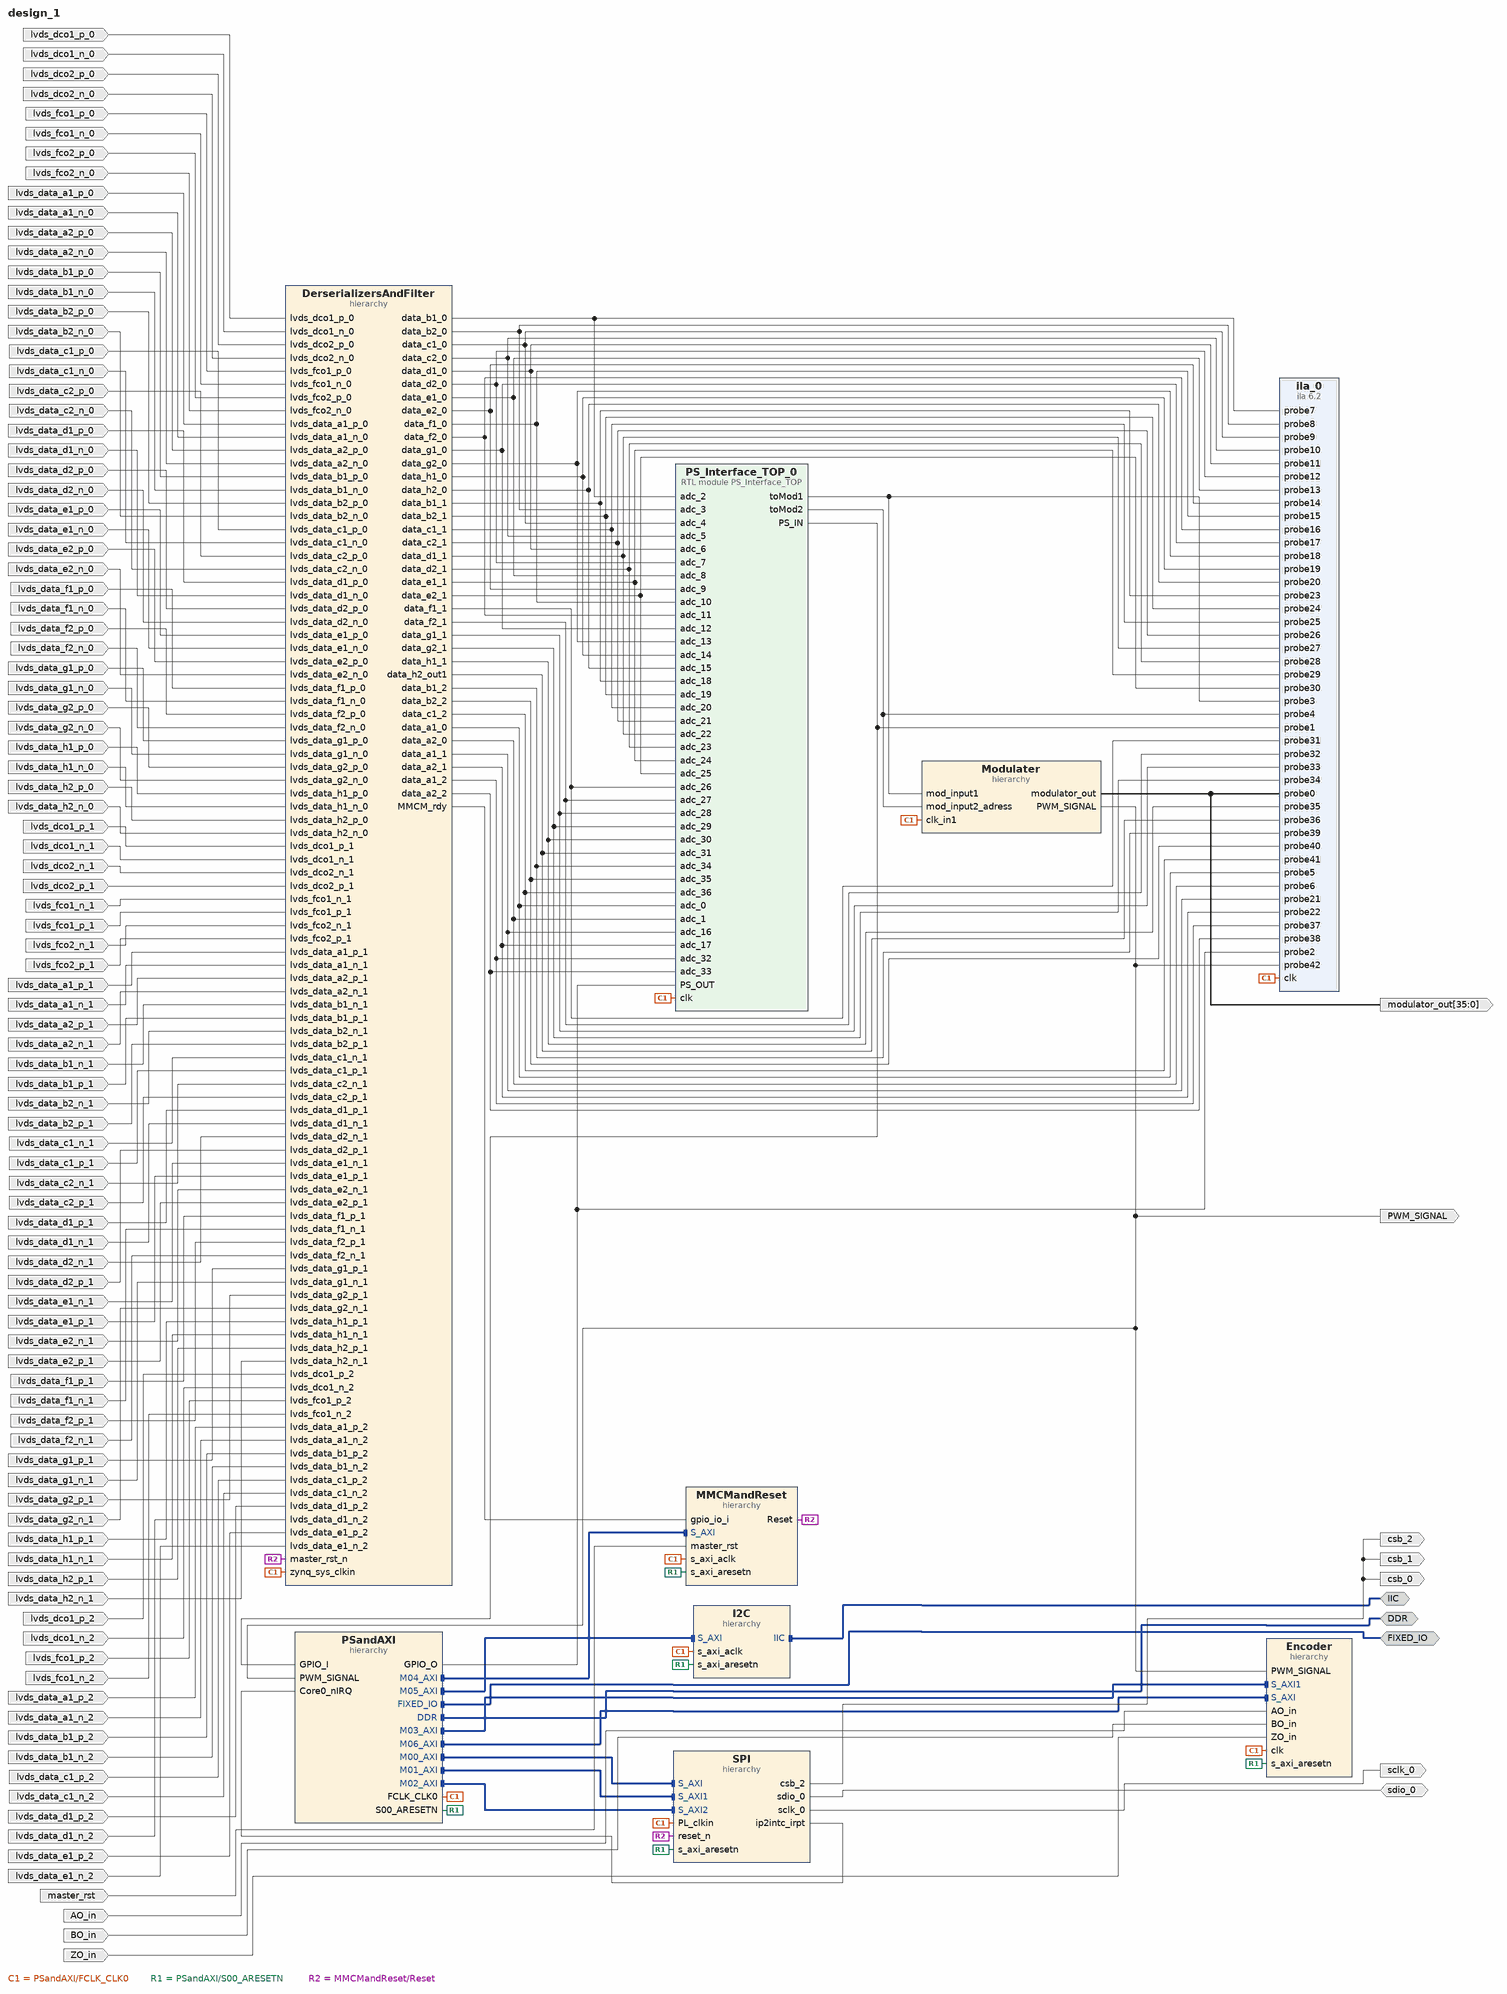
[diagram p0: block diagram of the top level]
# Vivado block design design_1, xc7z045ffg900-2, Vivado 2020.1
create_bd_design design_1

create_bd_intf_port -mode Master -vlnv xilinx.com:interface:ddrx_rtl:1.0 DDR
create_bd_intf_port -mode Master -vlnv xilinx.com:display_processing_system7:fixedio_rtl:1.0 FIXED_IO
create_bd_intf_port -mode Master -vlnv xilinx.com:interface:iic_rtl:1.0 IIC
create_bd_port -dir I AO_in
create_bd_port -dir I BO_in
create_bd_port -dir I ZO_in
create_bd_port -dir I lvds_dco1_p_0
create_bd_port -dir I lvds_dco1_n_0
create_bd_port -dir I lvds_dco2_p_0
create_bd_port -dir I lvds_dco2_n_0
create_bd_port -dir I lvds_fco1_p_0
create_bd_port -dir I lvds_fco1_n_0
create_bd_port -dir I lvds_fco2_p_0
create_bd_port -dir I lvds_fco2_n_0
create_bd_port -dir I lvds_data_a1_p_0
create_bd_port -dir I lvds_data_a1_n_0
create_bd_port -dir I lvds_data_a2_p_0
create_bd_port -dir I lvds_data_a2_n_0
create_bd_port -dir I lvds_data_b1_p_0
create_bd_port -dir I lvds_data_b1_n_0
create_bd_port -dir I lvds_data_b2_p_0
create_bd_port -dir I lvds_data_b2_n_0
create_bd_port -dir I lvds_data_c1_p_0
create_bd_port -dir I lvds_data_c1_n_0
create_bd_port -dir I lvds_data_c2_p_0
create_bd_port -dir I lvds_data_c2_n_0
create_bd_port -dir I lvds_data_d1_p_0
create_bd_port -dir I lvds_data_d1_n_0
create_bd_port -dir I lvds_data_d2_p_0
create_bd_port -dir I lvds_data_d2_n_0
create_bd_port -dir I lvds_data_e1_p_0
create_bd_port -dir I lvds_data_e1_n_0
create_bd_port -dir I lvds_data_e2_p_0
create_bd_port -dir I lvds_data_e2_n_0
create_bd_port -dir I lvds_data_f1_p_0
create_bd_port -dir I lvds_data_f1_n_0
create_bd_port -dir I lvds_data_f2_p_0
create_bd_port -dir I lvds_data_f2_n_0
create_bd_port -dir I lvds_data_g1_p_0
create_bd_port -dir I lvds_data_g1_n_0
create_bd_port -dir I lvds_data_g2_p_0
create_bd_port -dir I lvds_data_g2_n_0
create_bd_port -dir I lvds_data_h1_p_0
create_bd_port -dir I lvds_data_h1_n_0
create_bd_port -dir I lvds_data_h2_p_0
create_bd_port -dir I lvds_data_h2_n_0
create_bd_port -dir I lvds_data_a1_n_1
create_bd_port -dir I lvds_data_a1_p_1
create_bd_port -dir I lvds_data_a2_n_1
create_bd_port -dir I lvds_data_a2_p_1
create_bd_port -dir I lvds_data_b1_n_1
create_bd_port -dir I lvds_data_b1_p_1
create_bd_port -dir I lvds_data_b2_n_1
create_bd_port -dir I lvds_data_b2_p_1
create_bd_port -dir I lvds_data_c1_n_1
create_bd_port -dir I lvds_data_c1_p_1
create_bd_port -dir I lvds_data_c2_n_1
create_bd_port -dir I lvds_data_c2_p_1
create_bd_port -dir I lvds_data_d1_n_1
create_bd_port -dir I lvds_data_d1_p_1
create_bd_port -dir I lvds_data_d2_n_1
create_bd_port -dir I lvds_data_d2_p_1
create_bd_port -dir I lvds_data_e1_n_1
create_bd_port -dir I lvds_data_e1_p_1
create_bd_port -dir I lvds_data_e2_n_1
create_bd_port -dir I lvds_data_e2_p_1
create_bd_port -dir I lvds_data_f1_n_1
create_bd_port -dir I lvds_data_f1_p_1
create_bd_port -dir I lvds_data_f2_n_1
create_bd_port -dir I lvds_data_f2_p_1
create_bd_port -dir I lvds_data_g1_n_1
create_bd_port -dir I lvds_data_g1_p_1
create_bd_port -dir I lvds_data_g2_n_1
create_bd_port -dir I lvds_data_g2_p_1
create_bd_port -dir I lvds_data_h1_n_1
create_bd_port -dir I lvds_data_h1_p_1
create_bd_port -dir I lvds_data_h2_n_1
create_bd_port -dir I lvds_data_h2_p_1
create_bd_port -dir I lvds_dco1_n_1
create_bd_port -dir I lvds_dco1_p_1
create_bd_port -dir I lvds_dco2_n_1
create_bd_port -dir I lvds_dco2_p_1
create_bd_port -dir I lvds_fco1_n_1
create_bd_port -dir I lvds_fco1_p_1
create_bd_port -dir I lvds_fco2_n_1
create_bd_port -dir I lvds_fco2_p_1
create_bd_port -dir I lvds_data_a1_n_2
create_bd_port -dir I lvds_data_a1_p_2
create_bd_port -dir I lvds_data_d1_n_2
create_bd_port -dir I lvds_data_d1_p_2
create_bd_port -dir I lvds_data_b1_n_2
create_bd_port -dir I lvds_data_b1_p_2
create_bd_port -dir I lvds_data_e1_n_2
create_bd_port -dir I lvds_data_e1_p_2
create_bd_port -dir I lvds_data_c1_n_2
create_bd_port -dir I lvds_data_c1_p_2
create_bd_port -dir I lvds_dco1_n_2
create_bd_port -dir I lvds_dco1_p_2
create_bd_port -dir I lvds_fco1_n_2
create_bd_port -dir I lvds_fco1_p_2
create_bd_port -dir IO sdio_0
create_bd_port -dir O sclk_0
create_bd_port -dir O -from 35 -to 0 modulator_out
create_bd_port -dir O -type data PWM_SIGNAL
create_bd_port -dir O csb_0
create_bd_port -dir O csb_1
create_bd_port -dir O csb_2
create_bd_port -dir I master_rst

create_bd_cell -type ip -vlnv xilinx.com:ip:ila:6.2 ila_0
set_property -dict [list \
  CONFIG.C_ENABLE_ILA_AXI_MON false \
  CONFIG.C_MONITOR_TYPE Native \
  CONFIG.C_NUM_OF_PROBES 43 \
  CONFIG.C_PROBE0_WIDTH 36 \
  CONFIG.C_PROBE10_WIDTH 14 \
  CONFIG.C_PROBE11_WIDTH 14 \
  CONFIG.C_PROBE12_WIDTH 14 \
  CONFIG.C_PROBE13_WIDTH 14 \
  CONFIG.C_PROBE14_WIDTH 14 \
  CONFIG.C_PROBE15_WIDTH 14 \
  CONFIG.C_PROBE16_WIDTH 14 \
  CONFIG.C_PROBE17_WIDTH 14 \
  CONFIG.C_PROBE18_WIDTH 14 \
  CONFIG.C_PROBE19_WIDTH 14 \
  CONFIG.C_PROBE1_WIDTH 64 \
  CONFIG.C_PROBE20_WIDTH 14 \
  CONFIG.C_PROBE21_WIDTH 14 \
  CONFIG.C_PROBE22_WIDTH 14 \
  CONFIG.C_PROBE23_WIDTH 14 \
  CONFIG.C_PROBE24_WIDTH 14 \
  CONFIG.C_PROBE25_WIDTH 14 \
  CONFIG.C_PROBE26_WIDTH 14 \
  CONFIG.C_PROBE27_WIDTH 14 \
  CONFIG.C_PROBE28_WIDTH 14 \
  CONFIG.C_PROBE29_WIDTH 14 \
  CONFIG.C_PROBE2_WIDTH 64 \
  CONFIG.C_PROBE30_WIDTH 14 \
  CONFIG.C_PROBE31_WIDTH 14 \
  CONFIG.C_PROBE32_WIDTH 14 \
  CONFIG.C_PROBE33_WIDTH 14 \
  CONFIG.C_PROBE34_WIDTH 14 \
  CONFIG.C_PROBE35_WIDTH 14 \
  CONFIG.C_PROBE36_WIDTH 14 \
  CONFIG.C_PROBE37_WIDTH 14 \
  CONFIG.C_PROBE38_WIDTH 14 \
  CONFIG.C_PROBE39_WIDTH 14 \
  CONFIG.C_PROBE3_WIDTH 32 \
  CONFIG.C_PROBE40_WIDTH 14 \
  CONFIG.C_PROBE41_WIDTH 14 \
  CONFIG.C_PROBE4_WIDTH 32 \
  CONFIG.C_PROBE5_WIDTH 14 \
  CONFIG.C_PROBE6_WIDTH 14 \
  CONFIG.C_PROBE7_WIDTH 14 \
  CONFIG.C_PROBE8_WIDTH 14 \
  CONFIG.C_PROBE9_WIDTH 14 \
  CONFIG.C_SLOT_0_AXI_DATA_WIDTH 32 \
  CONFIG.C_SLOT_0_AXI_ID_WIDTH 1 \
] [get_bd_cells ila_0]
create_bd_cell -type hier DerserializersAndFilter
create_bd_cell -type hier SPI
create_bd_cell -type hier Encoder
create_bd_cell -type hier I2C
create_bd_cell -type hier Modulater
create_bd_cell -type hier MMCMandReset
create_bd_cell -type hier PSandAXI
create_bd_cell -type module -reference PS_Interface_TOP PS_Interface_TOP_0

# ---- hierarchy /DerserializersAndFilter ----
current_bd_instance /DerserializersAndFilter
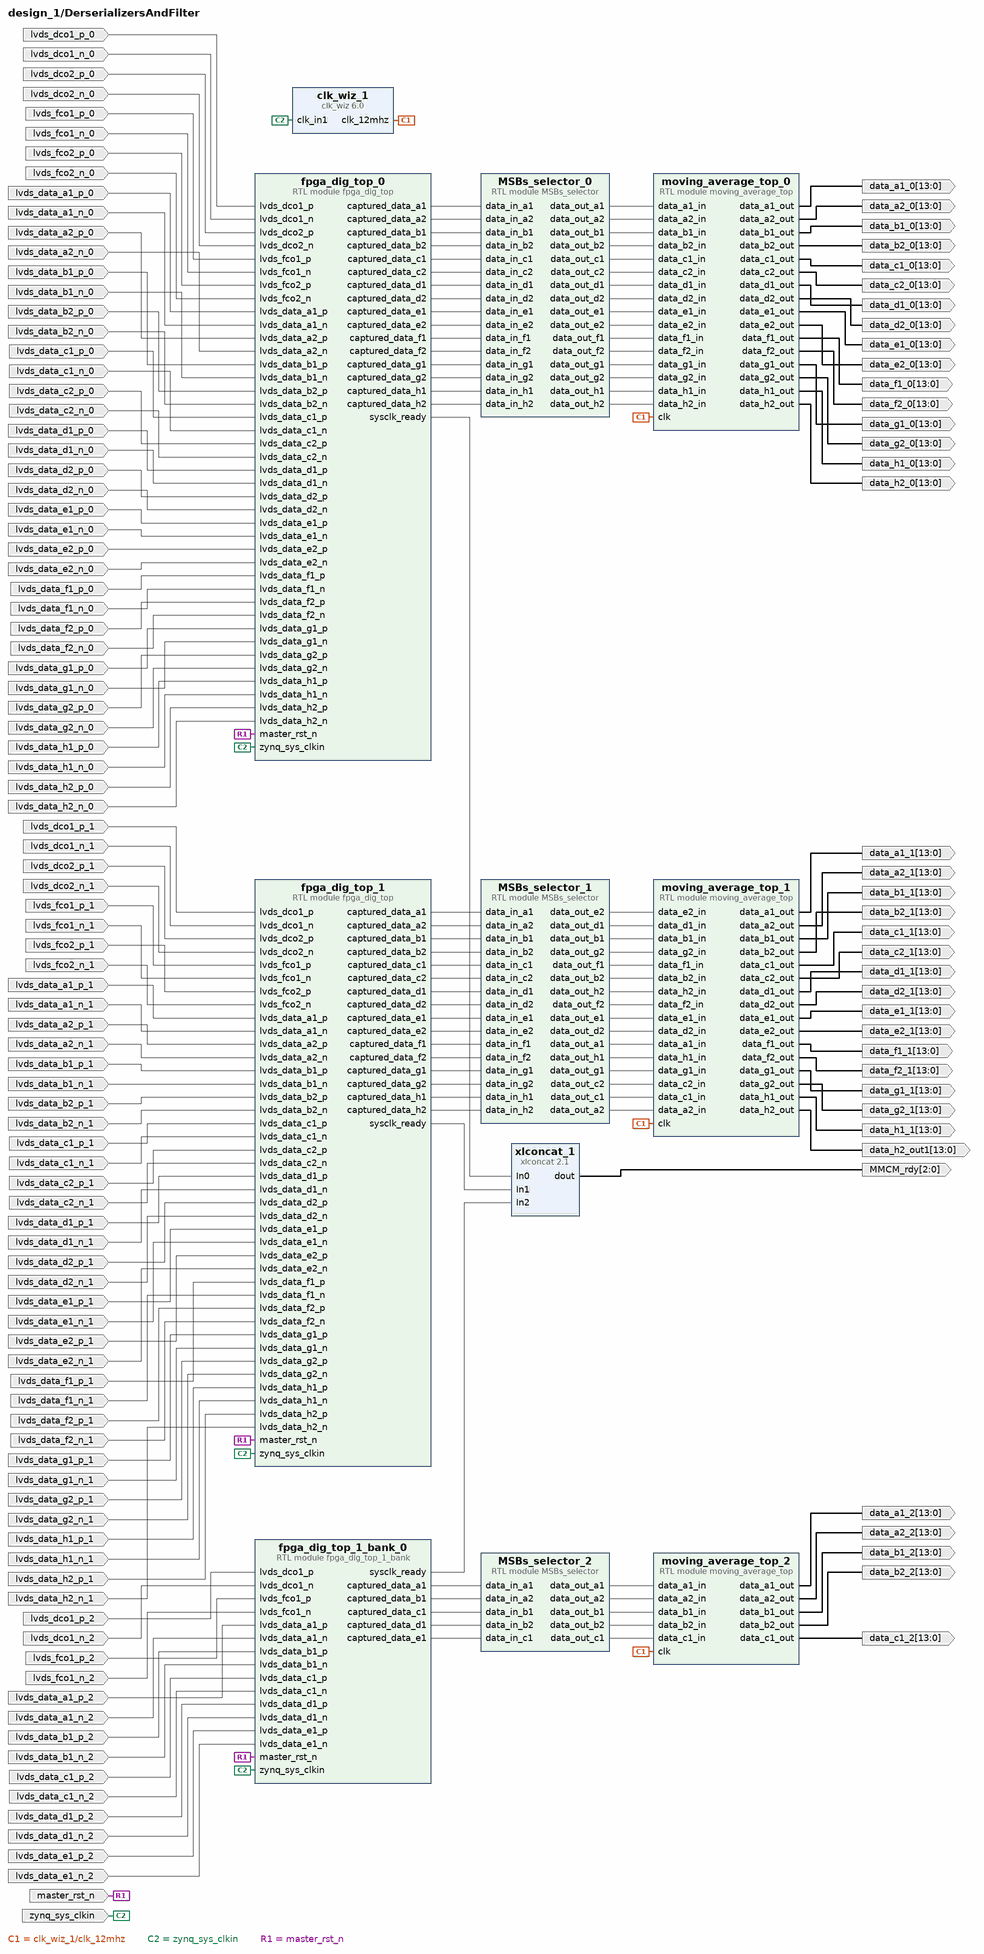
[diagram p1: block diagram inside /DerserializersAndFilter]
create_bd_pin -dir I -type clk zynq_sys_clkin
create_bd_pin -dir I lvds_dco1_p_2
create_bd_pin -dir I lvds_dco1_n_2
create_bd_pin -dir I lvds_fco1_p_2
create_bd_pin -dir I lvds_fco1_n_2
create_bd_pin -dir I lvds_data_a1_p_2
create_bd_pin -dir I lvds_data_a1_n_2
create_bd_pin -dir I lvds_data_b1_p_2
create_bd_pin -dir I lvds_data_b1_n_2
create_bd_pin -dir I lvds_data_c1_p_2
create_bd_pin -dir I lvds_data_c1_n_2
create_bd_pin -dir I lvds_data_d1_p_2
create_bd_pin -dir I lvds_data_d1_n_2
create_bd_pin -dir I lvds_data_e1_p_2
create_bd_pin -dir I lvds_data_e1_n_2
create_bd_pin -dir I -type rst master_rst_n
create_bd_pin -dir O -from 13 -to 0 data_a1_0
create_bd_pin -dir O -from 13 -to 0 data_a2_0
create_bd_pin -dir O -from 13 -to 0 data_b1_0
create_bd_pin -dir O -from 13 -to 0 data_b2_0
create_bd_pin -dir O -from 13 -to 0 data_c1_0
create_bd_pin -dir O -from 13 -to 0 data_c2_0
create_bd_pin -dir O -from 13 -to 0 data_d1_0
create_bd_pin -dir O -from 13 -to 0 data_d2_0
create_bd_pin -dir O -from 13 -to 0 data_e1_0
create_bd_pin -dir O -from 13 -to 0 data_e2_0
create_bd_pin -dir O -from 13 -to 0 data_f1_0
create_bd_pin -dir O -from 13 -to 0 data_f2_0
create_bd_pin -dir O -from 13 -to 0 data_g1_0
create_bd_pin -dir O -from 13 -to 0 data_g2_0
create_bd_pin -dir O -from 13 -to 0 data_h1_0
create_bd_pin -dir O -from 13 -to 0 data_h2_0
create_bd_pin -dir O -from 13 -to 0 data_a1_1
create_bd_pin -dir O -from 13 -to 0 data_a2_1
create_bd_pin -dir O -from 13 -to 0 data_b1_1
create_bd_pin -dir O -from 13 -to 0 data_b2_1
create_bd_pin -dir O -from 13 -to 0 data_c1_1
create_bd_pin -dir O -from 13 -to 0 data_c2_1
create_bd_pin -dir O -from 13 -to 0 data_d1_1
create_bd_pin -dir O -from 13 -to 0 data_d2_1
create_bd_pin -dir O -from 13 -to 0 data_e1_1
create_bd_pin -dir O -from 13 -to 0 data_e2_1
create_bd_pin -dir O -from 13 -to 0 data_f1_1
create_bd_pin -dir O -from 13 -to 0 data_f2_1
create_bd_pin -dir O -from 13 -to 0 data_g1_1
create_bd_pin -dir O -from 13 -to 0 data_g2_1
create_bd_pin -dir O -from 13 -to 0 data_h1_1
create_bd_pin -dir O -from 13 -to 0 data_h2_out1
create_bd_pin -dir O -from 2 -to 0 MMCM_rdy
create_bd_pin -dir O -from 13 -to 0 data_a1_2
create_bd_pin -dir O -from 13 -to 0 data_a2_2
create_bd_pin -dir O -from 13 -to 0 data_b1_2
create_bd_pin -dir O -from 13 -to 0 data_b2_2
create_bd_pin -dir O -from 13 -to 0 data_c1_2
create_bd_pin -dir I lvds_dco1_p_1
create_bd_pin -dir I lvds_dco1_n_1
create_bd_pin -dir I lvds_dco2_p_1
create_bd_pin -dir I lvds_dco2_n_1
create_bd_pin -dir I lvds_fco1_p_1
create_bd_pin -dir I lvds_fco1_n_1
create_bd_pin -dir I lvds_fco2_p_1
create_bd_pin -dir I lvds_fco2_n_1
create_bd_pin -dir I lvds_data_a1_p_1
create_bd_pin -dir I lvds_data_a1_n_1
create_bd_pin -dir I lvds_data_a2_p_1
create_bd_pin -dir I lvds_data_a2_n_1
create_bd_pin -dir I lvds_data_b1_p_1
create_bd_pin -dir I lvds_data_b1_n_1
create_bd_pin -dir I lvds_data_b2_p_1
create_bd_pin -dir I lvds_data_b2_n_1
create_bd_pin -dir I lvds_data_c1_p_1
create_bd_pin -dir I lvds_data_c1_n_1
create_bd_pin -dir I lvds_data_c2_p_1
create_bd_pin -dir I lvds_data_c2_n_1
create_bd_pin -dir I lvds_data_d1_p_1
create_bd_pin -dir I lvds_data_d1_n_1
create_bd_pin -dir I lvds_data_d2_p_1
create_bd_pin -dir I lvds_data_d2_n_1
create_bd_pin -dir I lvds_data_e1_p_1
create_bd_pin -dir I lvds_data_e1_n_1
create_bd_pin -dir I lvds_data_e2_p_1
create_bd_pin -dir I lvds_data_e2_n_1
create_bd_pin -dir I lvds_data_f1_p_1
create_bd_pin -dir I lvds_data_f1_n_1
create_bd_pin -dir I lvds_data_f2_p_1
create_bd_pin -dir I lvds_data_f2_n_1
create_bd_pin -dir I lvds_data_g1_p_1
create_bd_pin -dir I lvds_data_g1_n_1
create_bd_pin -dir I lvds_data_g2_p_1
create_bd_pin -dir I lvds_data_g2_n_1
create_bd_pin -dir I lvds_data_h1_p_1
create_bd_pin -dir I lvds_data_h1_n_1
create_bd_pin -dir I lvds_data_h2_p_1
create_bd_pin -dir I lvds_data_h2_n_1
create_bd_pin -dir I lvds_dco1_p_0
create_bd_pin -dir I lvds_dco1_n_0
create_bd_pin -dir I lvds_dco2_p_0
create_bd_pin -dir I lvds_dco2_n_0
create_bd_pin -dir I lvds_fco1_p_0
create_bd_pin -dir I lvds_fco1_n_0
create_bd_pin -dir I lvds_fco2_p_0
create_bd_pin -dir I lvds_fco2_n_0
create_bd_pin -dir I lvds_data_a1_p_0
create_bd_pin -dir I lvds_data_a1_n_0
create_bd_pin -dir I lvds_data_a2_p_0
create_bd_pin -dir I lvds_data_a2_n_0
create_bd_pin -dir I lvds_data_b1_p_0
create_bd_pin -dir I lvds_data_b1_n_0
create_bd_pin -dir I lvds_data_b2_p_0
create_bd_pin -dir I lvds_data_b2_n_0
create_bd_pin -dir I lvds_data_c1_p_0
create_bd_pin -dir I lvds_data_c1_n_0
create_bd_pin -dir I lvds_data_c2_p_0
create_bd_pin -dir I lvds_data_c2_n_0
create_bd_pin -dir I lvds_data_d1_p_0
create_bd_pin -dir I lvds_data_d1_n_0
create_bd_pin -dir I lvds_data_d2_p_0
create_bd_pin -dir I lvds_data_d2_n_0
create_bd_pin -dir I lvds_data_e1_p_0
create_bd_pin -dir I lvds_data_e1_n_0
create_bd_pin -dir I lvds_data_e2_p_0
create_bd_pin -dir I lvds_data_e2_n_0
create_bd_pin -dir I lvds_data_f1_p_0
create_bd_pin -dir I lvds_data_f1_n_0
create_bd_pin -dir I lvds_data_f2_p_0
create_bd_pin -dir I lvds_data_f2_n_0
create_bd_pin -dir I lvds_data_g1_p_0
create_bd_pin -dir I lvds_data_g1_n_0
create_bd_pin -dir I lvds_data_g2_p_0
create_bd_pin -dir I lvds_data_g2_n_0
create_bd_pin -dir I lvds_data_h1_p_0
create_bd_pin -dir I lvds_data_h1_n_0
create_bd_pin -dir I lvds_data_h2_p_0
create_bd_pin -dir I lvds_data_h2_n_0

create_bd_cell -type ip -vlnv xilinx.com:ip:clk_wiz:6.0 clk_wiz_1
set_property -dict [list \
  CONFIG.CLKOUT1_JITTER 345.775 \
  CONFIG.CLKOUT1_PHASE_ERROR 293.793 \
  CONFIG.CLKOUT1_REQUESTED_OUT_FREQ 12 \
  CONFIG.CLK_OUT1_PORT clk_12mhz \
  CONFIG.MMCM_CLKFBOUT_MULT_F 49.875 \
  CONFIG.MMCM_CLKOUT0_DIVIDE_F 83.125 \
  CONFIG.MMCM_DIVCLK_DIVIDE 5 \
] [get_bd_cells clk_wiz_1]
create_bd_cell -type module -reference fpga_dig_top_1_bank fpga_dig_top_1_bank_0
create_bd_cell -type ip -vlnv xilinx.com:ip:xlconcat:2.1 xlconcat_1
set_property -dict {CONFIG.IN0_WIDTH 1 CONFIG.IN1_WIDTH 1 CONFIG.IN2_WIDTH 1 CONFIG.NUM_PORTS 3} [get_bd_cells xlconcat_1]
create_bd_cell -type module -reference MSBs_selector MSBs_selector_0
create_bd_cell -type module -reference fpga_dig_top fpga_dig_top_1
create_bd_cell -type module -reference MSBs_selector MSBs_selector_1
create_bd_cell -type module -reference MSBs_selector MSBs_selector_2
create_bd_cell -type module -reference fpga_dig_top fpga_dig_top_0
create_bd_cell -type module -reference moving_average_top moving_average_top_0
set_property -dict {CONFIG.FilterSize_log2 0} [get_bd_cells moving_average_top_0]
create_bd_cell -type module -reference moving_average_top moving_average_top_1
set_property -dict {CONFIG.FilterSize_log2 0} [get_bd_cells moving_average_top_1]
create_bd_cell -type module -reference moving_average_top moving_average_top_2
set_property -dict {CONFIG.FilterSize_log2 0} [get_bd_cells moving_average_top_2]

# ---- hierarchy /SPI ----
current_bd_instance /SPI
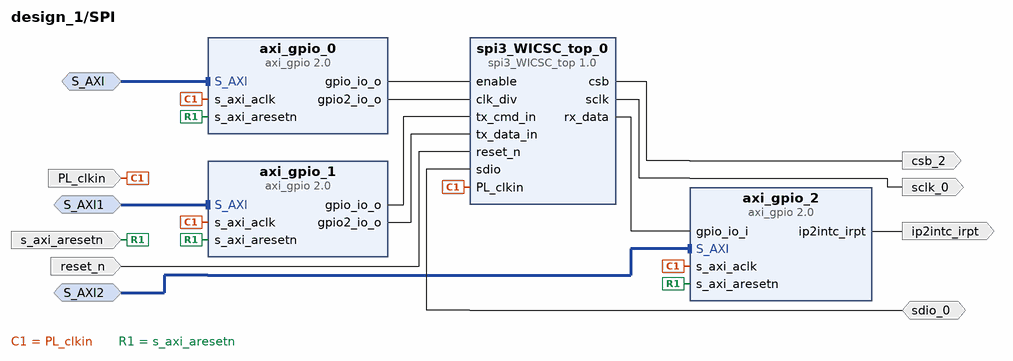
[diagram p2: block diagram inside /SPI]
create_bd_intf_pin -mode Slave -vlnv xilinx.com:interface:aximm_rtl:1.0 S_AXI
create_bd_intf_pin -mode Slave -vlnv xilinx.com:interface:aximm_rtl:1.0 S_AXI1
create_bd_intf_pin -mode Slave -vlnv xilinx.com:interface:aximm_rtl:1.0 S_AXI2
create_bd_pin -dir I -type clk PL_clkin
create_bd_pin -dir I -type rst s_axi_aresetn
create_bd_pin -dir O -type intr ip2intc_irpt
create_bd_pin -dir I -type rst reset_n
create_bd_pin -dir IO sdio_0
create_bd_pin -dir O sclk_0
create_bd_pin -dir O csb_2

create_bd_cell -type ip -vlnv xilinx.com:ip:axi_gpio:2.0 axi_gpio_0
set_property -dict [list \
  CONFIG.C_ALL_OUTPUTS 1 \
  CONFIG.C_ALL_OUTPUTS_2 1 \
  CONFIG.C_GPIO_WIDTH 1 \
  CONFIG.C_IS_DUAL 1 \
] [get_bd_cells axi_gpio_0]
create_bd_cell -type ip -vlnv xilinx.com:ip:axi_gpio:2.0 axi_gpio_1
set_property -dict [list \
  CONFIG.C_ALL_OUTPUTS 1 \
  CONFIG.C_ALL_OUTPUTS_2 1 \
  CONFIG.C_GPIO2_WIDTH 8 \
  CONFIG.C_GPIO_WIDTH 16 \
  CONFIG.C_IS_DUAL 1 \
] [get_bd_cells axi_gpio_1]
create_bd_cell -type ip -vlnv xilinx.com:ip:axi_gpio:2.0 axi_gpio_2
set_property -dict {CONFIG.C_ALL_INPUTS 1 CONFIG.C_GPIO_WIDTH 8 CONFIG.C_INTERRUPT_PRESENT 1} [get_bd_cells axi_gpio_2]
create_bd_cell -type ip -vlnv kth.se:user:spi3_WICSC_top:1.0 spi3_WICSC_top_0

# ---- hierarchy /Encoder ----
current_bd_instance /Encoder
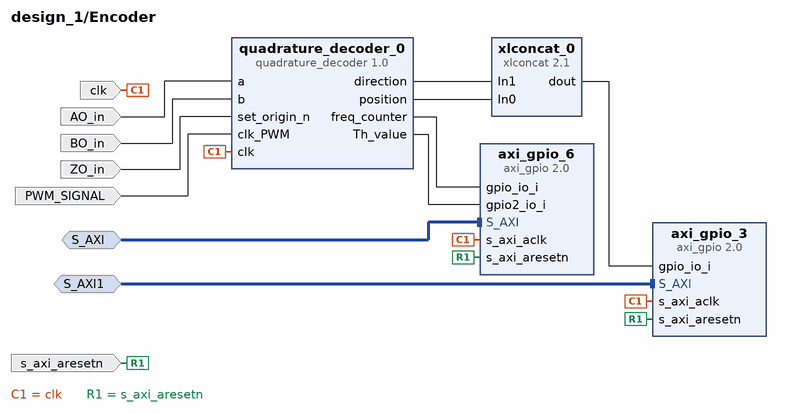
[diagram p3: block diagram inside /Encoder]
create_bd_intf_pin -mode Slave -vlnv xilinx.com:interface:aximm_rtl:1.0 S_AXI
create_bd_intf_pin -mode Slave -vlnv xilinx.com:interface:aximm_rtl:1.0 S_AXI1
create_bd_pin -dir I -type clk clk
create_bd_pin -dir I AO_in
create_bd_pin -dir I BO_in
create_bd_pin -dir I ZO_in
create_bd_pin -dir I PWM_SIGNAL
create_bd_pin -dir I -type rst s_axi_aresetn

create_bd_cell -type ip -vlnv kth.se:user:quadrature_decoder:1.0 quadrature_decoder_0
set_property -dict {CONFIG.debounce_time 50000 CONFIG.set_origin_debounce_time 500000} [get_bd_cells quadrature_decoder_0]
create_bd_cell -type ip -vlnv xilinx.com:ip:xlconcat:2.1 xlconcat_0
set_property -dict {CONFIG.IN0_WIDTH 16 CONFIG.IN1_WIDTH 1} [get_bd_cells xlconcat_0]
create_bd_cell -type ip -vlnv xilinx.com:ip:axi_gpio:2.0 axi_gpio_6
set_property -dict {CONFIG.C_ALL_INPUTS 1 CONFIG.C_ALL_INPUTS_2 1 CONFIG.C_IS_DUAL 1} [get_bd_cells axi_gpio_6]
create_bd_cell -type ip -vlnv xilinx.com:ip:axi_gpio:2.0 axi_gpio_3
set_property -dict {CONFIG.C_ALL_INPUTS 1 CONFIG.C_GPIO_WIDTH 17} [get_bd_cells axi_gpio_3]

# ---- hierarchy /I2C ----
current_bd_instance /I2C
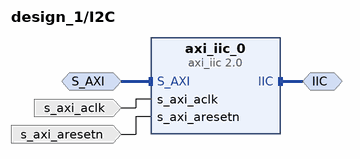
[diagram p4: block diagram inside /I2C]
create_bd_intf_pin -mode Slave -vlnv xilinx.com:interface:aximm_rtl:1.0 S_AXI
create_bd_intf_pin -mode Master -vlnv xilinx.com:interface:iic_rtl:1.0 IIC
create_bd_pin -dir I -type clk s_axi_aclk
create_bd_pin -dir I -type rst s_axi_aresetn

create_bd_cell -type ip -vlnv xilinx.com:ip:axi_iic:2.0 axi_iic_0

# ---- hierarchy /Modulater ----
current_bd_instance /Modulater
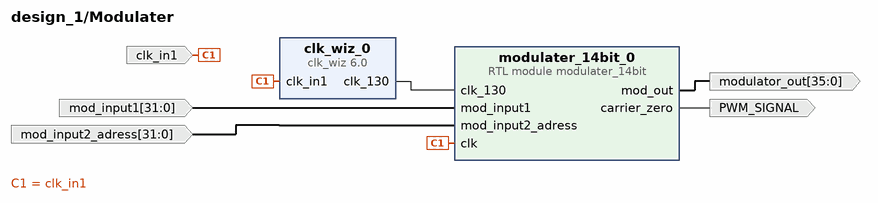
[diagram p5: block diagram inside /Modulater]
create_bd_pin -dir I -type clk clk_in1
create_bd_pin -dir I -from 31 -to 0 mod_input1
create_bd_pin -dir I -from 31 -to 0 mod_input2_adress
create_bd_pin -dir O -from 35 -to 0 modulator_out
create_bd_pin -dir O PWM_SIGNAL

create_bd_cell -type module -reference modulater_14bit modulater_14bit_0
create_bd_cell -type ip -vlnv xilinx.com:ip:clk_wiz:6.0 clk_wiz_0
set_property -dict [list \
  CONFIG.CLKOUT1_JITTER 231.118 \
  CONFIG.CLKOUT1_PHASE_ERROR 297.890 \
  CONFIG.CLKOUT1_REQUESTED_OUT_FREQ 130.000 \
  CONFIG.CLK_OUT1_PORT clk_130 \
  CONFIG.MMCM_CLKFBOUT_MULT_F 50.375 \
  CONFIG.MMCM_CLKOUT0_DIVIDE_F 7.750 \
  CONFIG.MMCM_DIVCLK_DIVIDE 5 \
] [get_bd_cells clk_wiz_0]

# ---- hierarchy /MMCMandReset ----
current_bd_instance /MMCMandReset
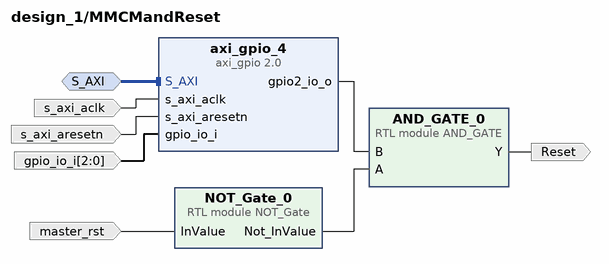
[diagram p6: block diagram inside /MMCMandReset]
create_bd_intf_pin -mode Slave -vlnv xilinx.com:interface:aximm_rtl:1.0 S_AXI
create_bd_pin -dir O Reset
create_bd_pin -dir I -type clk s_axi_aclk
create_bd_pin -dir I -type rst s_axi_aresetn
create_bd_pin -dir I -from 2 -to 0 gpio_io_i
create_bd_pin -dir I master_rst

create_bd_cell -type module -reference AND_GATE AND_GATE_0
create_bd_cell -type ip -vlnv xilinx.com:ip:axi_gpio:2.0 axi_gpio_4
set_property -dict [list \
  CONFIG.C_ALL_INPUTS 1 \
  CONFIG.C_ALL_OUTPUTS_2 1 \
  CONFIG.C_DOUT_DEFAULT_2 0xFFFFFFFF \
  CONFIG.C_GPIO2_WIDTH 1 \
  CONFIG.C_GPIO_WIDTH 3 \
  CONFIG.C_IS_DUAL 1 \
] [get_bd_cells axi_gpio_4]
create_bd_cell -type module -reference NOT_Gate NOT_Gate_0

# ---- hierarchy /PSandAXI ----
current_bd_instance /PSandAXI
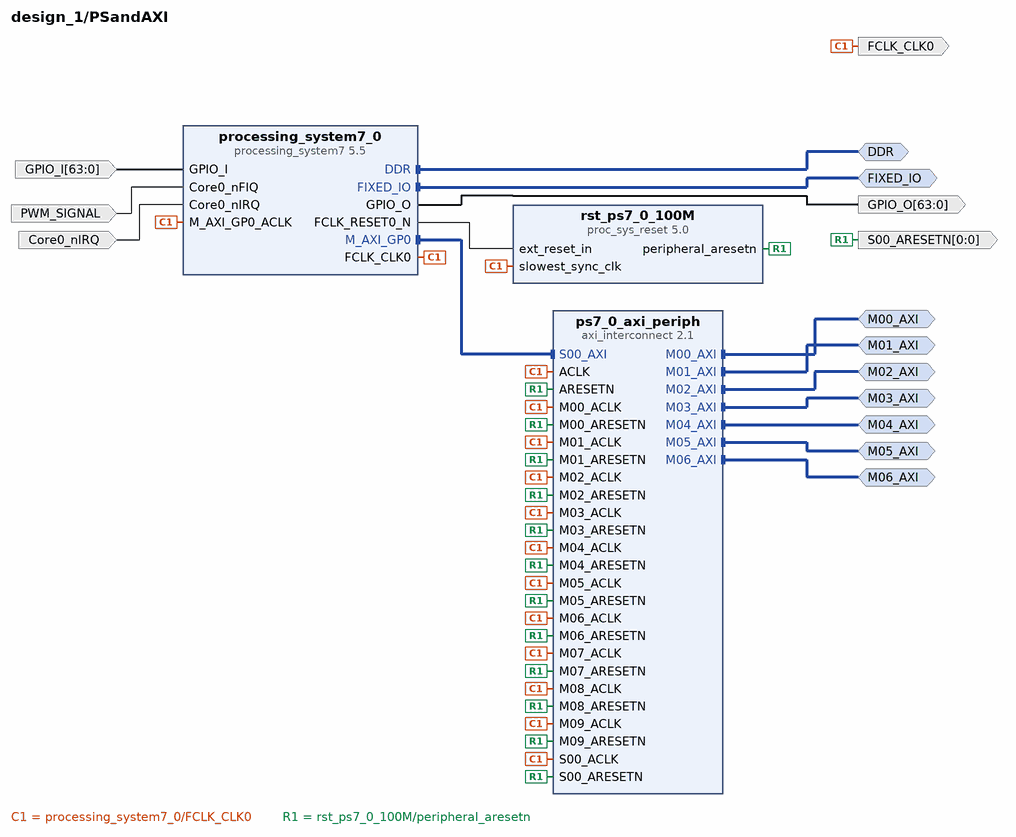
[diagram p7: block diagram inside /PSandAXI]
create_bd_intf_pin -mode Master -vlnv xilinx.com:interface:ddrx_rtl:1.0 DDR
create_bd_intf_pin -mode Master -vlnv xilinx.com:display_processing_system7:fixedio_rtl:1.0 FIXED_IO
create_bd_intf_pin -mode Master -vlnv xilinx.com:interface:aximm_rtl:1.0 M00_AXI
create_bd_intf_pin -mode Master -vlnv xilinx.com:interface:aximm_rtl:1.0 M01_AXI
create_bd_intf_pin -mode Master -vlnv xilinx.com:interface:aximm_rtl:1.0 M02_AXI
create_bd_intf_pin -mode Master -vlnv xilinx.com:interface:aximm_rtl:1.0 M03_AXI
create_bd_intf_pin -mode Master -vlnv xilinx.com:interface:aximm_rtl:1.0 M04_AXI
create_bd_intf_pin -mode Master -vlnv xilinx.com:interface:aximm_rtl:1.0 M05_AXI
create_bd_intf_pin -mode Master -vlnv xilinx.com:interface:aximm_rtl:1.0 M06_AXI
create_bd_pin -dir O -type clk FCLK_CLK0
create_bd_pin -dir O -from 0 -to 0 -type rst S00_ARESETN
create_bd_pin -dir I -from 63 -to 0 GPIO_I
create_bd_pin -dir O -from 63 -to 0 GPIO_O
create_bd_pin -dir I PWM_SIGNAL
create_bd_pin -dir I -type intr Core0_nIRQ

create_bd_cell -type ip -vlnv xilinx.com:ip:proc_sys_reset:5.0 rst_ps7_0_100M
create_bd_cell -type ip -vlnv xilinx.com:ip:processing_system7:5.5 processing_system7_0
set_property -dict [list \
  CONFIG.PCW_APU_PERIPHERAL_FREQMHZ 667.000000 \
  CONFIG.PCW_CORE0_FIQ_INTR 1 \
  CONFIG.PCW_CORE0_IRQ_INTR 1 \
  CONFIG.PCW_DUAL_PARALLEL_QSPI_DATA_MODE x8 \
  CONFIG.PCW_ENET0_ENET0_IO {MIO 16 .. 27} \
  CONFIG.PCW_ENET0_GRP_MDIO_ENABLE 1 \
  CONFIG.PCW_ENET0_GRP_MDIO_IO {MIO 52 .. 53} \
  CONFIG.PCW_ENET0_PERIPHERAL_ENABLE 1 \
  CONFIG.PCW_ENET0_PERIPHERAL_FREQMHZ {100 Mbps} \
  CONFIG.PCW_ENET0_RESET_ENABLE 1 \
  CONFIG.PCW_ENET0_RESET_IO {MIO 47} \
  CONFIG.PCW_ENET_RESET_ENABLE 1 \
  CONFIG.PCW_ENET_RESET_SELECT {Share reset pin} \
  CONFIG.PCW_FPGA0_PERIPHERAL_FREQMHZ 100 \
  CONFIG.PCW_GPIO_EMIO_GPIO_ENABLE 1 \
  CONFIG.PCW_GPIO_EMIO_GPIO_IO 64 \
  CONFIG.PCW_GPIO_MIO_GPIO_ENABLE 1 \
  CONFIG.PCW_GPIO_MIO_GPIO_IO MIO \
  CONFIG.PCW_I2C0_GRP_INT_ENABLE 0 \
  CONFIG.PCW_I2C0_I2C0_IO {MIO 50 .. 51} \
  CONFIG.PCW_I2C0_PERIPHERAL_ENABLE 1 \
  CONFIG.PCW_I2C0_RESET_ENABLE 1 \
  CONFIG.PCW_I2C0_RESET_IO {MIO 46} \
  CONFIG.PCW_I2C_PERIPHERAL_FREQMHZ 111.111115 \
  CONFIG.PCW_I2C_RESET_ENABLE 1 \
  CONFIG.PCW_I2C_RESET_SELECT {Share reset pin} \
  CONFIG.PCW_PRESET_BANK0_VOLTAGE {LVCMOS 1.8V} \
  CONFIG.PCW_PRESET_BANK1_VOLTAGE {LVCMOS 1.8V} \
  CONFIG.PCW_QSPI_GRP_FBCLK_ENABLE 1 \
  CONFIG.PCW_QSPI_GRP_FBCLK_IO {MIO 8} \
  CONFIG.PCW_QSPI_GRP_IO1_ENABLE 1 \
  CONFIG.PCW_QSPI_GRP_IO1_IO {MIO 0 9 .. 13} \
  CONFIG.PCW_QSPI_GRP_SINGLE_SS_ENABLE 0 \
  CONFIG.PCW_QSPI_INTERNAL_HIGHADDRESS 0xFDFFFFFF \
  CONFIG.PCW_QSPI_PERIPHERAL_ENABLE 1 \
  CONFIG.PCW_QSPI_QSPI_IO {MIO 1 .. 6} \
  CONFIG.PCW_SD0_GRP_CD_ENABLE 1 \
  CONFIG.PCW_SD0_GRP_CD_IO {MIO 14} \
  CONFIG.PCW_SD0_GRP_WP_ENABLE 1 \
  CONFIG.PCW_SD0_GRP_WP_IO {MIO 15} \
  CONFIG.PCW_SD0_PERIPHERAL_ENABLE 1 \
  CONFIG.PCW_SD0_SD0_IO {MIO 40 .. 45} \
  CONFIG.PCW_SDIO_PERIPHERAL_FREQMHZ 50 \
  CONFIG.PCW_TTC0_PERIPHERAL_ENABLE 1 \
  CONFIG.PCW_TTC0_TTC0_IO EMIO \
  CONFIG.PCW_UART1_PERIPHERAL_ENABLE 1 \
  CONFIG.PCW_UART1_UART1_IO {MIO 48 .. 49} \
  CONFIG.PCW_UART_PERIPHERAL_FREQMHZ 50 \
  CONFIG.PCW_UIPARAM_DDR_FREQ_MHZ 533.333313 \
  CONFIG.PCW_UIPARAM_DDR_PARTNO Custom \
  CONFIG.PCW_USB0_PERIPHERAL_ENABLE 1 \
  CONFIG.PCW_USB0_RESET_ENABLE 1 \
  CONFIG.PCW_USB0_RESET_IO {MIO 7} \
  CONFIG.PCW_USB0_USB0_IO {MIO 28 .. 39} \
  CONFIG.PCW_USB_RESET_ENABLE 1 \
  CONFIG.PCW_USB_RESET_SELECT {Share reset pin} \
  CONFIG.PCW_USE_FABRIC_INTERRUPT 1 \
  CONFIG.preset ZC706 \
] [get_bd_cells processing_system7_0]
# 237 more settings of processing_system7_0 are not shown: defaults, MIO pin electricals, DDR timing, and values the tool derives
create_bd_cell -type ip -vlnv xilinx.com:ip:axi_interconnect:2.1 ps7_0_axi_periph
set_property -dict {CONFIG.NUM_MI 10} [get_bd_cells ps7_0_axi_periph]

# ---- connections ----

current_bd_instance /DerserializersAndFilter
connect_bd_net [get_bd_pins clk_wiz_1/clk_12mhz] \
  [get_bd_pins moving_average_top_0/clk] [get_bd_pins moving_average_top_1/clk] [get_bd_pins moving_average_top_2/clk]
connect_bd_net [get_bd_pins fpga_dig_top_1_bank_0/sysclk_ready] [get_bd_pins xlconcat_1/In2]
connect_bd_net [get_bd_pins fpga_dig_top_1_bank_0/captured_data_a1] [get_bd_pins MSBs_selector_2/data_in_a1]
connect_bd_net [get_bd_pins fpga_dig_top_1_bank_0/captured_data_b1] [get_bd_pins MSBs_selector_2/data_in_a2]
connect_bd_net [get_bd_pins fpga_dig_top_1_bank_0/captured_data_c1] [get_bd_pins MSBs_selector_2/data_in_b1]
connect_bd_net [get_bd_pins fpga_dig_top_1_bank_0/captured_data_d1] [get_bd_pins MSBs_selector_2/data_in_b2]
connect_bd_net [get_bd_pins fpga_dig_top_1_bank_0/captured_data_e1] [get_bd_pins MSBs_selector_2/data_in_c1]
connect_bd_net [get_bd_pins MSBs_selector_0/data_out_a1] [get_bd_pins moving_average_top_0/data_a1_in]
connect_bd_net [get_bd_pins MSBs_selector_0/data_out_a2] [get_bd_pins moving_average_top_0/data_a2_in]
connect_bd_net [get_bd_pins MSBs_selector_0/data_out_b1] [get_bd_pins moving_average_top_0/data_b1_in]
connect_bd_net [get_bd_pins MSBs_selector_0/data_out_b2] [get_bd_pins moving_average_top_0/data_b2_in]
connect_bd_net [get_bd_pins MSBs_selector_0/data_out_c1] [get_bd_pins moving_average_top_0/data_c1_in]
connect_bd_net [get_bd_pins MSBs_selector_0/data_out_c2] [get_bd_pins moving_average_top_0/data_c2_in]
connect_bd_net [get_bd_pins MSBs_selector_0/data_out_d1] [get_bd_pins moving_average_top_0/data_d1_in]
connect_bd_net [get_bd_pins MSBs_selector_0/data_out_d2] [get_bd_pins moving_average_top_0/data_d2_in]
connect_bd_net [get_bd_pins MSBs_selector_0/data_out_e1] [get_bd_pins moving_average_top_0/data_e1_in]
connect_bd_net [get_bd_pins MSBs_selector_0/data_out_e2] [get_bd_pins moving_average_top_0/data_e2_in]
connect_bd_net [get_bd_pins MSBs_selector_0/data_out_f1] [get_bd_pins moving_average_top_0/data_f1_in]
connect_bd_net [get_bd_pins MSBs_selector_0/data_out_f2] [get_bd_pins moving_average_top_0/data_f2_in]
connect_bd_net [get_bd_pins MSBs_selector_0/data_out_g1] [get_bd_pins moving_average_top_0/data_g1_in]
connect_bd_net [get_bd_pins MSBs_selector_0/data_out_g2] [get_bd_pins moving_average_top_0/data_g2_in]
connect_bd_net [get_bd_pins MSBs_selector_0/data_out_h1] [get_bd_pins moving_average_top_0/data_h1_in]
connect_bd_net [get_bd_pins MSBs_selector_0/data_out_h2] [get_bd_pins moving_average_top_0/data_h2_in]
connect_bd_net [get_bd_pins fpga_dig_top_0/sysclk_ready] [get_bd_pins xlconcat_1/In0]
connect_bd_net [get_bd_pins fpga_dig_top_1/sysclk_ready] [get_bd_pins xlconcat_1/In1]
connect_bd_net [get_bd_pins MSBs_selector_2/data_out_a1] [get_bd_pins moving_average_top_2/data_a1_in]
connect_bd_net [get_bd_pins MSBs_selector_2/data_out_a2] [get_bd_pins moving_average_top_2/data_a2_in]
connect_bd_net [get_bd_pins MSBs_selector_2/data_out_b1] [get_bd_pins moving_average_top_2/data_b1_in]
connect_bd_net [get_bd_pins MSBs_selector_2/data_out_b2] [get_bd_pins moving_average_top_2/data_b2_in]
connect_bd_net [get_bd_pins MSBs_selector_2/data_out_c1] [get_bd_pins moving_average_top_2/data_c1_in]
connect_bd_net [get_bd_pins fpga_dig_top_0/captured_data_a1] [get_bd_pins MSBs_selector_0/data_in_a1]
connect_bd_net [get_bd_pins fpga_dig_top_0/captured_data_a2] [get_bd_pins MSBs_selector_0/data_in_a2]
connect_bd_net [get_bd_pins fpga_dig_top_0/captured_data_b1] [get_bd_pins MSBs_selector_0/data_in_b1]
connect_bd_net [get_bd_pins fpga_dig_top_0/captured_data_b2] [get_bd_pins MSBs_selector_0/data_in_b2]
connect_bd_net [get_bd_pins fpga_dig_top_0/captured_data_c1] [get_bd_pins MSBs_selector_0/data_in_c1]
connect_bd_net [get_bd_pins fpga_dig_top_0/captured_data_c2] [get_bd_pins MSBs_selector_0/data_in_c2]
connect_bd_net [get_bd_pins fpga_dig_top_0/captured_data_d1] [get_bd_pins MSBs_selector_0/data_in_d1]
connect_bd_net [get_bd_pins fpga_dig_top_0/captured_data_d2] [get_bd_pins MSBs_selector_0/data_in_d2]
connect_bd_net [get_bd_pins fpga_dig_top_0/captured_data_e1] [get_bd_pins MSBs_selector_0/data_in_e1]
connect_bd_net [get_bd_pins fpga_dig_top_0/captured_data_e2] [get_bd_pins MSBs_selector_0/data_in_e2]
connect_bd_net [get_bd_pins fpga_dig_top_0/captured_data_f1] [get_bd_pins MSBs_selector_0/data_in_f1]
connect_bd_net [get_bd_pins fpga_dig_top_0/captured_data_f2] [get_bd_pins MSBs_selector_0/data_in_f2]
connect_bd_net [get_bd_pins fpga_dig_top_0/captured_data_g1] [get_bd_pins MSBs_selector_0/data_in_g1]
connect_bd_net [get_bd_pins fpga_dig_top_0/captured_data_g2] [get_bd_pins MSBs_selector_0/data_in_g2]
connect_bd_net [get_bd_pins fpga_dig_top_0/captured_data_h1] [get_bd_pins MSBs_selector_0/data_in_h1]
connect_bd_net [get_bd_pins fpga_dig_top_0/captured_data_h2] [get_bd_pins MSBs_selector_0/data_in_h2]
connect_bd_net [get_bd_pins fpga_dig_top_1/captured_data_a1] [get_bd_pins MSBs_selector_1/data_in_a1]
connect_bd_net [get_bd_pins fpga_dig_top_1/captured_data_a2] [get_bd_pins MSBs_selector_1/data_in_a2]
connect_bd_net [get_bd_pins fpga_dig_top_1/captured_data_b1] [get_bd_pins MSBs_selector_1/data_in_b1]
connect_bd_net [get_bd_pins fpga_dig_top_1/captured_data_b2] [get_bd_pins MSBs_selector_1/data_in_b2]
connect_bd_net [get_bd_pins fpga_dig_top_1/captured_data_c1] [get_bd_pins MSBs_selector_1/data_in_c1]
connect_bd_net [get_bd_pins fpga_dig_top_1/captured_data_c2] [get_bd_pins MSBs_selector_1/data_in_c2]
connect_bd_net [get_bd_pins fpga_dig_top_1/captured_data_d1] [get_bd_pins MSBs_selector_1/data_in_d1]
connect_bd_net [get_bd_pins fpga_dig_top_1/captured_data_d2] [get_bd_pins MSBs_selector_1/data_in_d2]
connect_bd_net [get_bd_pins fpga_dig_top_1/captured_data_e1] [get_bd_pins MSBs_selector_1/data_in_e1]
connect_bd_net [get_bd_pins fpga_dig_top_1/captured_data_e2] [get_bd_pins MSBs_selector_1/data_in_e2]
connect_bd_net [get_bd_pins fpga_dig_top_1/captured_data_f1] [get_bd_pins MSBs_selector_1/data_in_f1]
connect_bd_net [get_bd_pins fpga_dig_top_1/captured_data_f2] [get_bd_pins MSBs_selector_1/data_in_f2]
connect_bd_net [get_bd_pins fpga_dig_top_1/captured_data_g1] [get_bd_pins MSBs_selector_1/data_in_g1]
connect_bd_net [get_bd_pins fpga_dig_top_1/captured_data_g2] [get_bd_pins MSBs_selector_1/data_in_g2]
connect_bd_net [get_bd_pins fpga_dig_top_1/captured_data_h1] [get_bd_pins MSBs_selector_1/data_in_h1]
connect_bd_net [get_bd_pins fpga_dig_top_1/captured_data_h2] [get_bd_pins MSBs_selector_1/data_in_h2]
connect_bd_net -net processing_system7_0_FCLK_CLK0 [get_bd_pins zynq_sys_clkin] \
  [get_bd_pins fpga_dig_top_1/zynq_sys_clkin] [get_bd_pins fpga_dig_top_1_bank_0/zynq_sys_clkin] \
  [get_bd_pins fpga_dig_top_0/zynq_sys_clkin] [get_bd_pins clk_wiz_1/clk_in1]
connect_bd_net -net lvds_dco1_p_2_1 [get_bd_pins lvds_dco1_p_2] [get_bd_pins fpga_dig_top_1_bank_0/lvds_dco1_p]
connect_bd_net -net lvds_dco1_n_2_1 [get_bd_pins lvds_dco1_n_2] [get_bd_pins fpga_dig_top_1_bank_0/lvds_dco1_n]
connect_bd_net -net lvds_fco1_p_2_1 [get_bd_pins lvds_fco1_p_2] [get_bd_pins fpga_dig_top_1_bank_0/lvds_fco1_p]
connect_bd_net -net lvds_fco1_n_2_1 [get_bd_pins lvds_fco1_n_2] [get_bd_pins fpga_dig_top_1_bank_0/lvds_fco1_n]
connect_bd_net -net lvds_data_a1_p_2_1 [get_bd_pins lvds_data_a1_p_2] [get_bd_pins fpga_dig_top_1_bank_0/lvds_data_a1_p]
connect_bd_net -net lvds_data_a1_n_2_1 [get_bd_pins lvds_data_a1_n_2] [get_bd_pins fpga_dig_top_1_bank_0/lvds_data_a1_n]
connect_bd_net -net lvds_data_b1_p_2_1 [get_bd_pins lvds_data_b1_p_2] [get_bd_pins fpga_dig_top_1_bank_0/lvds_data_b1_p]
connect_bd_net -net lvds_data_b1_n_2_1 [get_bd_pins lvds_data_b1_n_2] [get_bd_pins fpga_dig_top_1_bank_0/lvds_data_b1_n]
connect_bd_net -net lvds_data_c1_p_2_1 [get_bd_pins lvds_data_c1_p_2] [get_bd_pins fpga_dig_top_1_bank_0/lvds_data_c1_p]
connect_bd_net -net lvds_data_c1_n_2_1 [get_bd_pins lvds_data_c1_n_2] [get_bd_pins fpga_dig_top_1_bank_0/lvds_data_c1_n]
connect_bd_net -net lvds_data_d1_p_2_1 [get_bd_pins lvds_data_d1_p_2] [get_bd_pins fpga_dig_top_1_bank_0/lvds_data_d1_p]
connect_bd_net -net lvds_data_d1_n_2_1 [get_bd_pins lvds_data_d1_n_2] [get_bd_pins fpga_dig_top_1_bank_0/lvds_data_d1_n]
connect_bd_net -net lvds_data_e1_p_2_1 [get_bd_pins lvds_data_e1_p_2] [get_bd_pins fpga_dig_top_1_bank_0/lvds_data_e1_p]
connect_bd_net -net lvds_data_e1_n_2_1 [get_bd_pins lvds_data_e1_n_2] [get_bd_pins fpga_dig_top_1_bank_0/lvds_data_e1_n]
connect_bd_net -net AND_GATE_0_Y [get_bd_pins master_rst_n] \
  [get_bd_pins fpga_dig_top_0/master_rst_n] [get_bd_pins fpga_dig_top_1/master_rst_n] \
  [get_bd_pins fpga_dig_top_1_bank_0/master_rst_n]
connect_bd_net -net MSBs_selector_0_data_out_a1 [get_bd_pins moving_average_top_0/data_a1_out] [get_bd_pins data_a1_0]
connect_bd_net -net MSBs_selector_0_data_out_a2 [get_bd_pins moving_average_top_0/data_a2_out] [get_bd_pins data_a2_0]
connect_bd_net -net MSBs_selector_0_data_out_b1 [get_bd_pins moving_average_top_0/data_b1_out] [get_bd_pins data_b1_0]
connect_bd_net -net MSBs_selector_0_data_out_b2 [get_bd_pins moving_average_top_0/data_b2_out] [get_bd_pins data_b2_0]
connect_bd_net -net MSBs_selector_0_data_out_c1 [get_bd_pins moving_average_top_0/data_c1_out] [get_bd_pins data_c1_0]
connect_bd_net -net MSBs_selector_0_data_out_c2 [get_bd_pins moving_average_top_0/data_c2_out] [get_bd_pins data_c2_0]
connect_bd_net -net MSBs_selector_0_data_out_d1 [get_bd_pins moving_average_top_0/data_d1_out] [get_bd_pins data_d1_0]
connect_bd_net -net MSBs_selector_0_data_out_d2 [get_bd_pins moving_average_top_0/data_d2_out] [get_bd_pins data_d2_0]
connect_bd_net -net MSBs_selector_0_data_out_e1 [get_bd_pins moving_average_top_0/data_e1_out] [get_bd_pins data_e1_0]
connect_bd_net -net MSBs_selector_0_data_out_e2 [get_bd_pins moving_average_top_0/data_e2_out] [get_bd_pins data_e2_0]
connect_bd_net -net MSBs_selector_0_data_out_f1 [get_bd_pins moving_average_top_0/data_f1_out] [get_bd_pins data_f1_0]
connect_bd_net -net MSBs_selector_0_data_out_f2 [get_bd_pins moving_average_top_0/data_f2_out] [get_bd_pins data_f2_0]
connect_bd_net -net MSBs_selector_0_data_out_g1 [get_bd_pins moving_average_top_0/data_g1_out] [get_bd_pins data_g1_0]
connect_bd_net -net MSBs_selector_0_data_out_g2 [get_bd_pins moving_average_top_0/data_g2_out] [get_bd_pins data_g2_0]
connect_bd_net -net MSBs_selector_0_data_out_h1 [get_bd_pins moving_average_top_0/data_h1_out] [get_bd_pins data_h1_0]
connect_bd_net -net MSBs_selector_0_data_out_h2 [get_bd_pins moving_average_top_0/data_h2_out] [get_bd_pins data_h2_0]
connect_bd_net [get_bd_pins xlconcat_1/dout] [get_bd_pins MMCM_rdy]
connect_bd_net -net MSBs_selector_2_data_out_a1 [get_bd_pins moving_average_top_2/data_a1_out] [get_bd_pins data_a1_2]
connect_bd_net -net MSBs_selector_2_data_out_a2 [get_bd_pins moving_average_top_2/data_a2_out] [get_bd_pins data_a2_2]
connect_bd_net -net MSBs_selector_2_data_out_b1 [get_bd_pins moving_average_top_2/data_b1_out] [get_bd_pins data_b1_2]
connect_bd_net -net MSBs_selector_2_data_out_b2 [get_bd_pins moving_average_top_2/data_b2_out] [get_bd_pins data_b2_2]
connect_bd_net -net MSBs_selector_2_data_out_c1 [get_bd_pins moving_average_top_2/data_c1_out] [get_bd_pins data_c1_2]
connect_bd_net -net lvds_dco1_p_1_2 [get_bd_pins lvds_dco1_p_1] [get_bd_pins fpga_dig_top_1/lvds_dco1_p]
connect_bd_net -net lvds_dco1_n_1_2 [get_bd_pins lvds_dco1_n_1] [get_bd_pins fpga_dig_top_1/lvds_dco1_n]
connect_bd_net -net lvds_dco2_p_1_1 [get_bd_pins lvds_dco2_p_1] [get_bd_pins fpga_dig_top_1/lvds_dco2_p]
connect_bd_net -net lvds_dco2_n_1_1 [get_bd_pins lvds_dco2_n_1] [get_bd_pins fpga_dig_top_1/lvds_dco2_n]
connect_bd_net -net lvds_fco1_p_1_1 [get_bd_pins lvds_fco1_p_1] [get_bd_pins fpga_dig_top_1/lvds_fco1_p]
connect_bd_net -net lvds_fco1_n_1_1 [get_bd_pins lvds_fco1_n_1] [get_bd_pins fpga_dig_top_1/lvds_fco1_n]
connect_bd_net -net lvds_fco2_p_1_1 [get_bd_pins lvds_fco2_p_1] [get_bd_pins fpga_dig_top_1/lvds_fco2_p]
connect_bd_net -net lvds_fco2_n_1_1 [get_bd_pins lvds_fco2_n_1] [get_bd_pins fpga_dig_top_1/lvds_fco2_n]
connect_bd_net -net lvds_data_a1_p_1_1 [get_bd_pins lvds_data_a1_p_1] [get_bd_pins fpga_dig_top_1/lvds_data_a1_p]
connect_bd_net -net lvds_data_a1_n_1_1 [get_bd_pins lvds_data_a1_n_1] [get_bd_pins fpga_dig_top_1/lvds_data_a1_n]
connect_bd_net -net lvds_data_a2_p_1_1 [get_bd_pins lvds_data_a2_p_1] [get_bd_pins fpga_dig_top_1/lvds_data_a2_p]
connect_bd_net -net lvds_data_a2_n_1_1 [get_bd_pins lvds_data_a2_n_1] [get_bd_pins fpga_dig_top_1/lvds_data_a2_n]
connect_bd_net -net lvds_data_b1_p_1_1 [get_bd_pins lvds_data_b1_p_1] [get_bd_pins fpga_dig_top_1/lvds_data_b1_p]
connect_bd_net -net lvds_data_b1_n_1_1 [get_bd_pins lvds_data_b1_n_1] [get_bd_pins fpga_dig_top_1/lvds_data_b1_n]
connect_bd_net -net lvds_data_b2_p_1_1 [get_bd_pins lvds_data_b2_p_1] [get_bd_pins fpga_dig_top_1/lvds_data_b2_p]
connect_bd_net -net lvds_data_b2_n_1_1 [get_bd_pins lvds_data_b2_n_1] [get_bd_pins fpga_dig_top_1/lvds_data_b2_n]
connect_bd_net -net lvds_data_c1_p_1_1 [get_bd_pins lvds_data_c1_p_1] [get_bd_pins fpga_dig_top_1/lvds_data_c1_p]
connect_bd_net -net lvds_data_c1_n_1_1 [get_bd_pins lvds_data_c1_n_1] [get_bd_pins fpga_dig_top_1/lvds_data_c1_n]
connect_bd_net -net lvds_data_c2_p_1_1 [get_bd_pins lvds_data_c2_p_1] [get_bd_pins fpga_dig_top_1/lvds_data_c2_p]
connect_bd_net -net lvds_data_c2_n_1_1 [get_bd_pins lvds_data_c2_n_1] [get_bd_pins fpga_dig_top_1/lvds_data_c2_n]
connect_bd_net -net lvds_data_d1_p_1_1 [get_bd_pins lvds_data_d1_p_1] [get_bd_pins fpga_dig_top_1/lvds_data_d1_p]
connect_bd_net -net lvds_data_d1_n_1_1 [get_bd_pins lvds_data_d1_n_1] [get_bd_pins fpga_dig_top_1/lvds_data_d1_n]
connect_bd_net -net lvds_data_d2_p_1_1 [get_bd_pins lvds_data_d2_p_1] [get_bd_pins fpga_dig_top_1/lvds_data_d2_p]
connect_bd_net -net lvds_data_d2_n_1_1 [get_bd_pins lvds_data_d2_n_1] [get_bd_pins fpga_dig_top_1/lvds_data_d2_n]
connect_bd_net -net lvds_data_e1_p_1_1 [get_bd_pins lvds_data_e1_p_1] [get_bd_pins fpga_dig_top_1/lvds_data_e1_p]
connect_bd_net -net lvds_data_e1_n_1_1 [get_bd_pins lvds_data_e1_n_1] [get_bd_pins fpga_dig_top_1/lvds_data_e1_n]
connect_bd_net -net lvds_data_e2_p_1_1 [get_bd_pins lvds_data_e2_p_1] [get_bd_pins fpga_dig_top_1/lvds_data_e2_p]
connect_bd_net -net lvds_data_e2_n_1_1 [get_bd_pins lvds_data_e2_n_1] [get_bd_pins fpga_dig_top_1/lvds_data_e2_n]
connect_bd_net -net lvds_data_f1_p_1_1 [get_bd_pins lvds_data_f1_p_1] [get_bd_pins fpga_dig_top_1/lvds_data_f1_p]
connect_bd_net -net lvds_data_f1_n_1_1 [get_bd_pins lvds_data_f1_n_1] [get_bd_pins fpga_dig_top_1/lvds_data_f1_n]
connect_bd_net -net lvds_data_f2_p_1_1 [get_bd_pins lvds_data_f2_p_1] [get_bd_pins fpga_dig_top_1/lvds_data_f2_p]
connect_bd_net -net lvds_data_f2_n_1_1 [get_bd_pins lvds_data_f2_n_1] [get_bd_pins fpga_dig_top_1/lvds_data_f2_n]
connect_bd_net -net lvds_data_g1_p_1_1 [get_bd_pins lvds_data_g1_p_1] [get_bd_pins fpga_dig_top_1/lvds_data_g1_p]
connect_bd_net -net lvds_data_g1_n_1_1 [get_bd_pins lvds_data_g1_n_1] [get_bd_pins fpga_dig_top_1/lvds_data_g1_n]
connect_bd_net -net lvds_data_g2_p_1_1 [get_bd_pins lvds_data_g2_p_1] [get_bd_pins fpga_dig_top_1/lvds_data_g2_p]
connect_bd_net -net lvds_data_g2_n_1_1 [get_bd_pins lvds_data_g2_n_1] [get_bd_pins fpga_dig_top_1/lvds_data_g2_n]
connect_bd_net -net lvds_data_h1_p_1_1 [get_bd_pins lvds_data_h1_p_1] [get_bd_pins fpga_dig_top_1/lvds_data_h1_p]
connect_bd_net -net lvds_data_h1_n_1_1 [get_bd_pins lvds_data_h1_n_1] [get_bd_pins fpga_dig_top_1/lvds_data_h1_n]
connect_bd_net -net lvds_data_h2_p_1_1 [get_bd_pins lvds_data_h2_p_1] [get_bd_pins fpga_dig_top_1/lvds_data_h2_p]
connect_bd_net -net lvds_data_h2_n_1_1 [get_bd_pins lvds_data_h2_n_1] [get_bd_pins fpga_dig_top_1/lvds_data_h2_n]
connect_bd_net -net lvds_dco1_p_1_1 [get_bd_pins lvds_dco1_p_0] [get_bd_pins fpga_dig_top_0/lvds_dco1_p]
connect_bd_net -net lvds_dco1_n_1_1 [get_bd_pins lvds_dco1_n_0] [get_bd_pins fpga_dig_top_0/lvds_dco1_n]
connect_bd_net -net lvds_dco2_p_0_1 [get_bd_pins lvds_dco2_p_0] [get_bd_pins fpga_dig_top_0/lvds_dco2_p]
connect_bd_net -net lvds_dco2_n_0_1 [get_bd_pins lvds_dco2_n_0] [get_bd_pins fpga_dig_top_0/lvds_dco2_n]
connect_bd_net -net lvds_fco1_p_0_1 [get_bd_pins lvds_fco1_p_0] [get_bd_pins fpga_dig_top_0/lvds_fco1_p]
connect_bd_net -net lvds_fco1_n_0_1 [get_bd_pins lvds_fco1_n_0] [get_bd_pins fpga_dig_top_0/lvds_fco1_n]
connect_bd_net -net lvds_fco2_p_0_1 [get_bd_pins lvds_fco2_p_0] [get_bd_pins fpga_dig_top_0/lvds_fco2_p]
connect_bd_net -net lvds_fco2_n_0_1 [get_bd_pins lvds_fco2_n_0] [get_bd_pins fpga_dig_top_0/lvds_fco2_n]
connect_bd_net -net lvds_data_a1_p_0_1 [get_bd_pins lvds_data_a1_p_0] [get_bd_pins fpga_dig_top_0/lvds_data_a1_p]
connect_bd_net -net lvds_data_a1_n_0_1 [get_bd_pins lvds_data_a1_n_0] [get_bd_pins fpga_dig_top_0/lvds_data_a1_n]
connect_bd_net -net lvds_data_a2_p_0_1 [get_bd_pins lvds_data_a2_p_0] [get_bd_pins fpga_dig_top_0/lvds_data_a2_p]
connect_bd_net -net lvds_data_a2_n_0_1 [get_bd_pins lvds_data_a2_n_0] [get_bd_pins fpga_dig_top_0/lvds_data_a2_n]
connect_bd_net -net lvds_data_b1_p_0_1 [get_bd_pins lvds_data_b1_p_0] [get_bd_pins fpga_dig_top_0/lvds_data_b1_p]
connect_bd_net -net lvds_data_b1_n_0_1 [get_bd_pins lvds_data_b1_n_0] [get_bd_pins fpga_dig_top_0/lvds_data_b1_n]
connect_bd_net -net lvds_data_b2_p_0_1 [get_bd_pins lvds_data_b2_p_0] [get_bd_pins fpga_dig_top_0/lvds_data_b2_p]
connect_bd_net -net lvds_data_b2_n_0_1 [get_bd_pins lvds_data_b2_n_0] [get_bd_pins fpga_dig_top_0/lvds_data_b2_n]
connect_bd_net -net lvds_data_c1_p_0_1 [get_bd_pins lvds_data_c1_p_0] [get_bd_pins fpga_dig_top_0/lvds_data_c1_p]
connect_bd_net -net lvds_data_c1_n_0_1 [get_bd_pins lvds_data_c1_n_0] [get_bd_pins fpga_dig_top_0/lvds_data_c1_n]
connect_bd_net -net lvds_data_c2_p_0_1 [get_bd_pins lvds_data_c2_p_0] [get_bd_pins fpga_dig_top_0/lvds_data_c2_p]
connect_bd_net -net lvds_data_c2_n_0_1 [get_bd_pins lvds_data_c2_n_0] [get_bd_pins fpga_dig_top_0/lvds_data_c2_n]
connect_bd_net -net lvds_data_d1_p_0_1 [get_bd_pins lvds_data_d1_p_0] [get_bd_pins fpga_dig_top_0/lvds_data_d1_p]
connect_bd_net -net lvds_data_d1_n_0_1 [get_bd_pins lvds_data_d1_n_0] [get_bd_pins fpga_dig_top_0/lvds_data_d1_n]
connect_bd_net -net lvds_data_d2_p_0_1 [get_bd_pins lvds_data_d2_p_0] [get_bd_pins fpga_dig_top_0/lvds_data_d2_p]
connect_bd_net -net lvds_data_d2_n_0_1 [get_bd_pins lvds_data_d2_n_0] [get_bd_pins fpga_dig_top_0/lvds_data_d2_n]
connect_bd_net -net lvds_data_e1_p_0_1 [get_bd_pins lvds_data_e1_p_0] [get_bd_pins fpga_dig_top_0/lvds_data_e1_p]
connect_bd_net -net lvds_data_e1_n_0_1 [get_bd_pins lvds_data_e1_n_0] [get_bd_pins fpga_dig_top_0/lvds_data_e1_n]
connect_bd_net -net lvds_data_e2_p_0_1 [get_bd_pins lvds_data_e2_p_0] [get_bd_pins fpga_dig_top_0/lvds_data_e2_p]
connect_bd_net -net lvds_data_e2_n_0_1 [get_bd_pins lvds_data_e2_n_0] [get_bd_pins fpga_dig_top_0/lvds_data_e2_n]
connect_bd_net -net lvds_data_f1_p_0_1 [get_bd_pins lvds_data_f1_p_0] [get_bd_pins fpga_dig_top_0/lvds_data_f1_p]
connect_bd_net -net lvds_data_f1_n_0_1 [get_bd_pins lvds_data_f1_n_0] [get_bd_pins fpga_dig_top_0/lvds_data_f1_n]
connect_bd_net -net lvds_data_f2_p_0_1 [get_bd_pins lvds_data_f2_p_0] [get_bd_pins fpga_dig_top_0/lvds_data_f2_p]
connect_bd_net -net lvds_data_f2_n_0_1 [get_bd_pins lvds_data_f2_n_0] [get_bd_pins fpga_dig_top_0/lvds_data_f2_n]
connect_bd_net -net lvds_data_g1_p_0_1 [get_bd_pins lvds_data_g1_p_0] [get_bd_pins fpga_dig_top_0/lvds_data_g1_p]
connect_bd_net -net lvds_data_g1_n_0_1 [get_bd_pins lvds_data_g1_n_0] [get_bd_pins fpga_dig_top_0/lvds_data_g1_n]
connect_bd_net -net lvds_data_g2_p_0_1 [get_bd_pins lvds_data_g2_p_0] [get_bd_pins fpga_dig_top_0/lvds_data_g2_p]
connect_bd_net -net lvds_data_g2_n_0_1 [get_bd_pins lvds_data_g2_n_0] [get_bd_pins fpga_dig_top_0/lvds_data_g2_n]
connect_bd_net -net lvds_data_h1_p_0_1 [get_bd_pins lvds_data_h1_p_0] [get_bd_pins fpga_dig_top_0/lvds_data_h1_p]
connect_bd_net -net lvds_data_h1_n_0_1 [get_bd_pins lvds_data_h1_n_0] [get_bd_pins fpga_dig_top_0/lvds_data_h1_n]
connect_bd_net -net lvds_data_h2_p_0_1 [get_bd_pins lvds_data_h2_p_0] [get_bd_pins fpga_dig_top_0/lvds_data_h2_p]
connect_bd_net -net lvds_data_h2_n_0_1 [get_bd_pins lvds_data_h2_n_0] [get_bd_pins fpga_dig_top_0/lvds_data_h2_n]
connect_bd_net [get_bd_pins MSBs_selector_1/data_out_e2] [get_bd_pins moving_average_top_1/data_e2_in]
connect_bd_net [get_bd_pins MSBs_selector_1/data_out_d1] [get_bd_pins moving_average_top_1/data_d1_in]
connect_bd_net [get_bd_pins MSBs_selector_1/data_out_b1] [get_bd_pins moving_average_top_1/data_b1_in]
connect_bd_net -net MSBs_selector_1_data_out_c1 [get_bd_pins moving_average_top_1/data_c1_out] [get_bd_pins data_c1_1]
connect_bd_net -net MSBs_selector_1_data_out_b2 [get_bd_pins moving_average_top_1/data_b2_out] [get_bd_pins data_b2_1]
connect_bd_net -net MSBs_selector_1_data_out_a2 [get_bd_pins moving_average_top_1/data_a2_out] [get_bd_pins data_a2_1]
connect_bd_net -net MSBs_selector_1_data_out_a1 [get_bd_pins moving_average_top_1/data_a1_out] [get_bd_pins data_a1_1]
connect_bd_net [get_bd_pins MSBs_selector_1/data_out_g2] [get_bd_pins moving_average_top_1/data_g2_in]
connect_bd_net [get_bd_pins MSBs_selector_1/data_out_f1] [get_bd_pins moving_average_top_1/data_f1_in]
connect_bd_net [get_bd_pins MSBs_selector_1/data_out_b2] [get_bd_pins moving_average_top_1/data_b2_in]
connect_bd_net -net MSBs_selector_1_data_out_h2 [get_bd_pins moving_average_top_1/data_h2_out] [get_bd_pins data_h2_out1]
connect_bd_net -net MSBs_selector_1_data_out_h1 [get_bd_pins moving_average_top_1/data_h1_out] [get_bd_pins data_h1_1]
connect_bd_net -net MSBs_selector_1_data_out_f2 [get_bd_pins moving_average_top_1/data_f2_out] [get_bd_pins data_f2_1]
connect_bd_net -net MSBs_selector_1_data_out_f1 [get_bd_pins moving_average_top_1/data_f1_out] [get_bd_pins data_f1_1]
connect_bd_net -net MSBs_selector_1_data_out_e1 [get_bd_pins moving_average_top_1/data_e1_out] [get_bd_pins data_e1_1]
connect_bd_net -net MSBs_selector_1_data_out_d2 [get_bd_pins moving_average_top_1/data_d2_out] [get_bd_pins data_d2_1]
connect_bd_net -net MSBs_selector_1_data_out_d1 [get_bd_pins moving_average_top_1/data_d1_out] [get_bd_pins data_d1_1]
connect_bd_net -net MSBs_selector_1_data_out_b1 [get_bd_pins moving_average_top_1/data_b1_out] [get_bd_pins data_b1_1]
connect_bd_net -net MSBs_selector_1_data_out_c2 [get_bd_pins moving_average_top_1/data_c2_out] [get_bd_pins data_c2_1]
connect_bd_net [get_bd_pins MSBs_selector_1/data_out_h2] [get_bd_pins moving_average_top_1/data_h2_in]
connect_bd_net [get_bd_pins MSBs_selector_1/data_out_f2] [get_bd_pins moving_average_top_1/data_f2_in]
connect_bd_net [get_bd_pins MSBs_selector_1/data_out_e1] [get_bd_pins moving_average_top_1/data_e1_in]
connect_bd_net [get_bd_pins MSBs_selector_1/data_out_d2] [get_bd_pins moving_average_top_1/data_d2_in]
connect_bd_net [get_bd_pins MSBs_selector_1/data_out_a1] [get_bd_pins moving_average_top_1/data_a1_in]
connect_bd_net -net MSBs_selector_1_data_out_g1 [get_bd_pins moving_average_top_1/data_g1_out] [get_bd_pins data_g1_1]
connect_bd_net [get_bd_pins MSBs_selector_1/data_out_h1] [get_bd_pins moving_average_top_1/data_h1_in]
connect_bd_net [get_bd_pins MSBs_selector_1/data_out_g1] [get_bd_pins moving_average_top_1/data_g1_in]
connect_bd_net [get_bd_pins MSBs_selector_1/data_out_c2] [get_bd_pins moving_average_top_1/data_c2_in]
connect_bd_net [get_bd_pins MSBs_selector_1/data_out_c1] [get_bd_pins moving_average_top_1/data_c1_in]
connect_bd_net [get_bd_pins MSBs_selector_1/data_out_a2] [get_bd_pins moving_average_top_1/data_a2_in]
connect_bd_net -net MSBs_selector_1_data_out_g2 [get_bd_pins moving_average_top_1/data_g2_out] [get_bd_pins data_g2_1]
connect_bd_net -net MSBs_selector_1_data_out_e2 [get_bd_pins moving_average_top_1/data_e2_out] [get_bd_pins data_e2_1]
